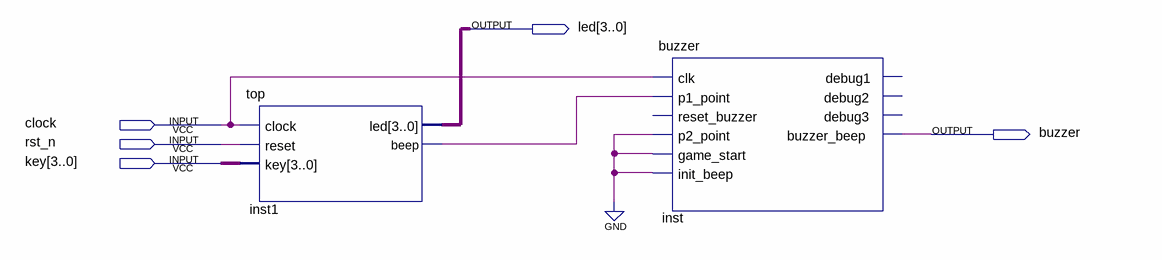
[diagram p0: schematic sheet]
// Quartus schematic test_top.bdf as structural Verilog: 2 symbols, 5 pins
module test_top (
  input  clock,
  input  rst_n,
  input  [3:0] key,
  output [3:0] led,
  output buzzer
);

  wire inst1_beep;

  top inst1 (.clock(clock), .reset(rst_n), .key(key), .led(led), .beep(inst1_beep));
  buzzer inst (
    .clk(clock), .p1_point(inst1_beep), .p2_point(1'b0), .game_start(1'b0), .init_beep(1'b0),
    .buzzer_beep(buzzer));  // open: reset_buzzer, debug1, debug2, debug3
endmodule
